# Altium schematic sheet ExternalConnections.SchDoc
size A4
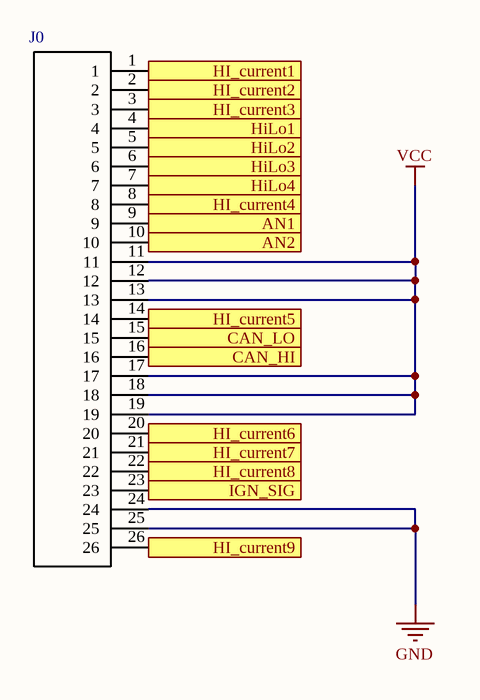
[diagram p0: ExternalConnections.SchDoc]

## Parts
J0  6473418-1  [*TE_6473418-1]  (value not drawn)

## Ports
AN1, AN2, CAN_HI, CAN_LO, HI_current1, HI_current2, HI_current3, HI_current4, HI_current5, HI_current6, HI_current7, HI_current8, HI_current9, HiLo1, HiLo2, HiLo3, HiLo4, IGN_SIG

## Nets
GND: J0.24 J0.25
VCC: J0.11 J0.12 J0.13 J0.17 J0.18 J0.19
AN1: J0.9 ; port AN1
AN2: J0.10 ; port AN2
CAN_HI: J0.16 ; port CAN_HI
CAN_LO: J0.15 ; port CAN_LO
HI_current1: J0.1 ; port HI_current1
HI_current2: J0.2 ; port HI_current2
HI_current3: J0.3 ; port HI_current3
HI_current4: J0.8 ; port HI_current4
HI_current5: J0.14 ; port HI_current5
HI_current6: J0.20 ; port HI_current6
HI_current7: J0.21 ; port HI_current7
HI_current8: J0.22 ; port HI_current8
HI_current9: J0.26 ; port HI_current9
HiLo1: J0.4 ; port HiLo1
HiLo2: J0.5 ; port HiLo2
HiLo3: J0.6 ; port HiLo3
HiLo4: J0.7 ; port HiLo4
IGN_SIG: J0.23 ; port IGN_SIG

## Library data of the parts
J0 = 6473418-1: Conn Shrouded Header PIN 26 POS 1.5mm Solder ST Thru-Hole Automotive Tube; MF: TE Connectivity; MP: 6473418-1; Digi-Key_Part_Number: A121634-ND; EU_RoHS_Compliance: Compliant; Package: None; Digi-Key_Purchase_URL: https://www.digikey.com/product-detail/en/te-connectivity-amp-connectors/6473418-1/A121634-ND/2329277?utm_source=snapeda&utm_medium=aggregator&utm_campaign=symbol; SnapEDA_Link: https://www.snapeda.com/parts/6473418-1/TE%20Connectivity%20AMP%20Connectors/view-part/885463/?ref=snap; TE_purchase_URL: https://www.te.com/usa-en/product-6473418-1.html?te_bu=Cor&te_type=disp&te_campaign=seda_glo_cor-seda-global-disp-prtnr-fy19-seda-model-bom-cta_sma-317_1&elqCampaignId=32493; Value: *